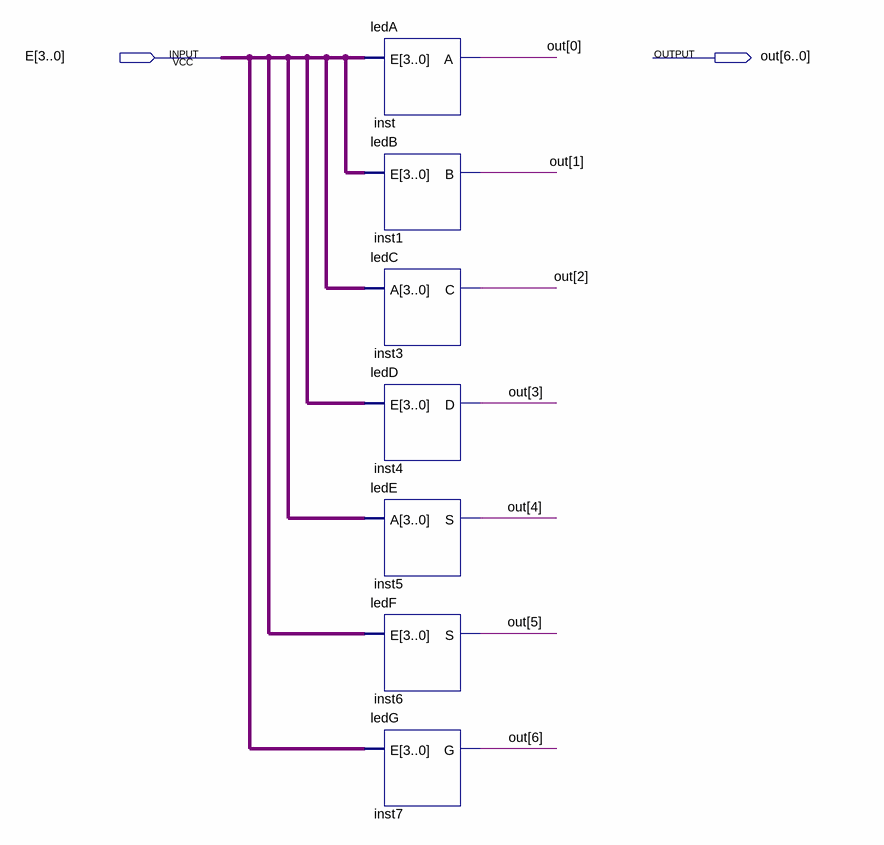
[diagram p0: schematic sheet]
// Quartus schematic display.bdf as structural Verilog: 7 symbols, 2 pins
module display (
  input  [3:0] E,
  output [6:0] out
);

  ledA inst (.E(E), .A(out[0]));
  ledB inst1 (.E(E), .B(out[1]));
  ledC inst3 (.A(E), .C(out[2]));
  ledD inst4 (.E(E), .D(out[3]));
  ledE inst5 (.A(E), .S(out[4]));
  ledF inst6 (.E(E), .S(out[5]));
  ledG inst7 (.E(E), .G(out[6]));
endmodule
